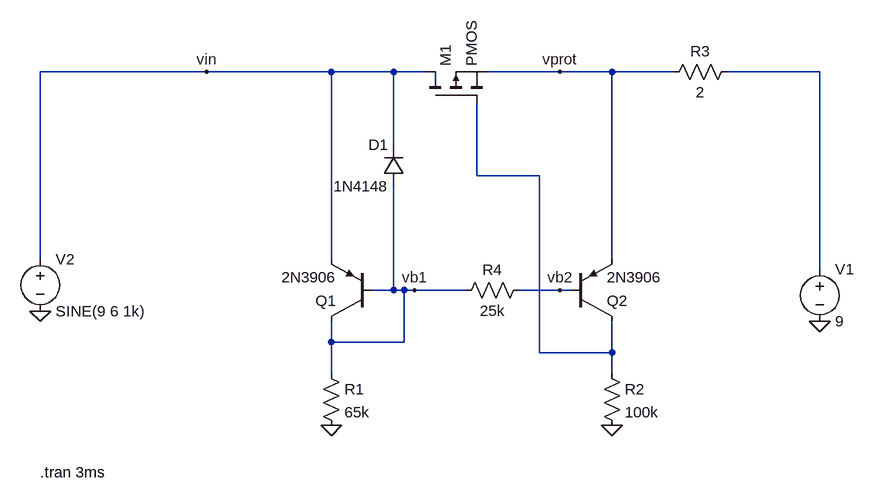
[diagram p0: schematic ideal-diode.asc]
ideal-diode.asc, the LTspice schematic file:
Version 4
SHEET 1 1352 680
WIRE -160 -176 -416 -176
WIRE 32 -176 -160 -176
WIRE 128 -176 32 -176
WIRE 176 -176 128 -176
WIRE 384 -176 272 -176
WIRE 464 -176 384 -176
WIRE 560 -176 464 -176
WIRE 784 -176 640 -176
WIRE 128 -64 128 -176
WIRE 256 -16 256 -128
WIRE 352 -16 256 -16
WIRE -416 112 -416 -176
WIRE 32 112 32 -176
WIRE 464 112 464 -176
WIRE 784 128 784 -176
WIRE 128 160 128 0
WIRE 128 160 96 160
WIRE 144 160 128 160
WIRE 160 160 144 160
WIRE 240 160 160 160
WIRE 384 160 320 160
WIRE 400 160 384 160
WIRE 32 240 32 208
WIRE 144 240 144 160
WIRE 144 240 32 240
WIRE 352 256 352 -16
WIRE 464 256 464 208
WIRE 464 256 352 256
WIRE 32 288 32 240
WIRE 464 288 464 256
FLAG -416 192 0
FLAG 32 368 0
FLAG 464 368 0
FLAG 784 208 0
FLAG 160 160 vb1
FLAG 384 160 vb2
FLAG -160 -176 vin
FLAG 384 -176 vprot
SYMBOL pnp 96 208 R180
SYMATTR InstName Q1
SYMATTR Value 2N3906
SYMBOL pnp 400 208 M180
SYMATTR InstName Q2
SYMATTR Value 2N3906
SYMBOL pmos 176 -128 R270
SYMATTR InstName M1
SYMBOL res 16 272 R0
SYMATTR InstName R1
SYMATTR Value 65k
SYMBOL res 448 272 R0
SYMATTR InstName R2
SYMATTR Value 100k
SYMBOL res 544 -160 R270
WINDOW 0 32 56 VTop 2
WINDOW 3 0 56 VBottom 2
SYMATTR InstName R3
SYMATTR Value 2
SYMBOL voltage 784 112 R0
WINDOW 123 0 0 Left 0
WINDOW 39 0 0 Left 0
SYMATTR InstName V1
SYMATTR Value 9
SYMBOL voltage -416 96 R0
WINDOW 123 0 0 Left 0
WINDOW 39 0 0 Left 0
SYMATTR InstName V2
SYMATTR Value SINE(9 6 1k)
SYMBOL res 336 144 R90
WINDOW 0 0 56 VBottom 2
WINDOW 3 32 56 VTop 2
SYMATTR InstName R4
SYMATTR Value 25k
SYMBOL diode 144 0 R180
WINDOW 0 24 64 Left 2
WINDOW 3 24 0 Left 2
SYMATTR InstName D1
SYMATTR Value 1N4148
TEXT -416 440 Left 2 !.tran 3ms

The netlist it stands for:
* ideal-diode.asc
Q1 vb1 vb1 vin 0 2N3906
Q2 N002 vb2 vprot 0 2N3906
M1 vin N002 vprot vprot PMOS
R1 vb1 0 65k
R2 N002 0 100k
R3 vprot N001 2
V1 N001 0 9
V2 vin 0 SINE(9 6 1k)
R4 vb2 vb1 25k
D1 vb1 vin 1N4148
.model D D
.lib standard.dio
.model NPN NPN
.model PNP PNP
.lib standard.bjt
.model NMOS NMOS
.model PMOS PMOS
.lib standard.mos
.tran 3ms
.backanno
.end